# EasyEDA Pro project Ninjahub.eprj

# Schematic Schematic1
Board Name: Board1; Create Date: 2026-04-02; Page Name: P1; Project Name: Ninjahub; Schematic Name: Schematic1; Update Date: 2026-04-02; Company: EasyEDA.com; Page Size: A4; Version: V1.0
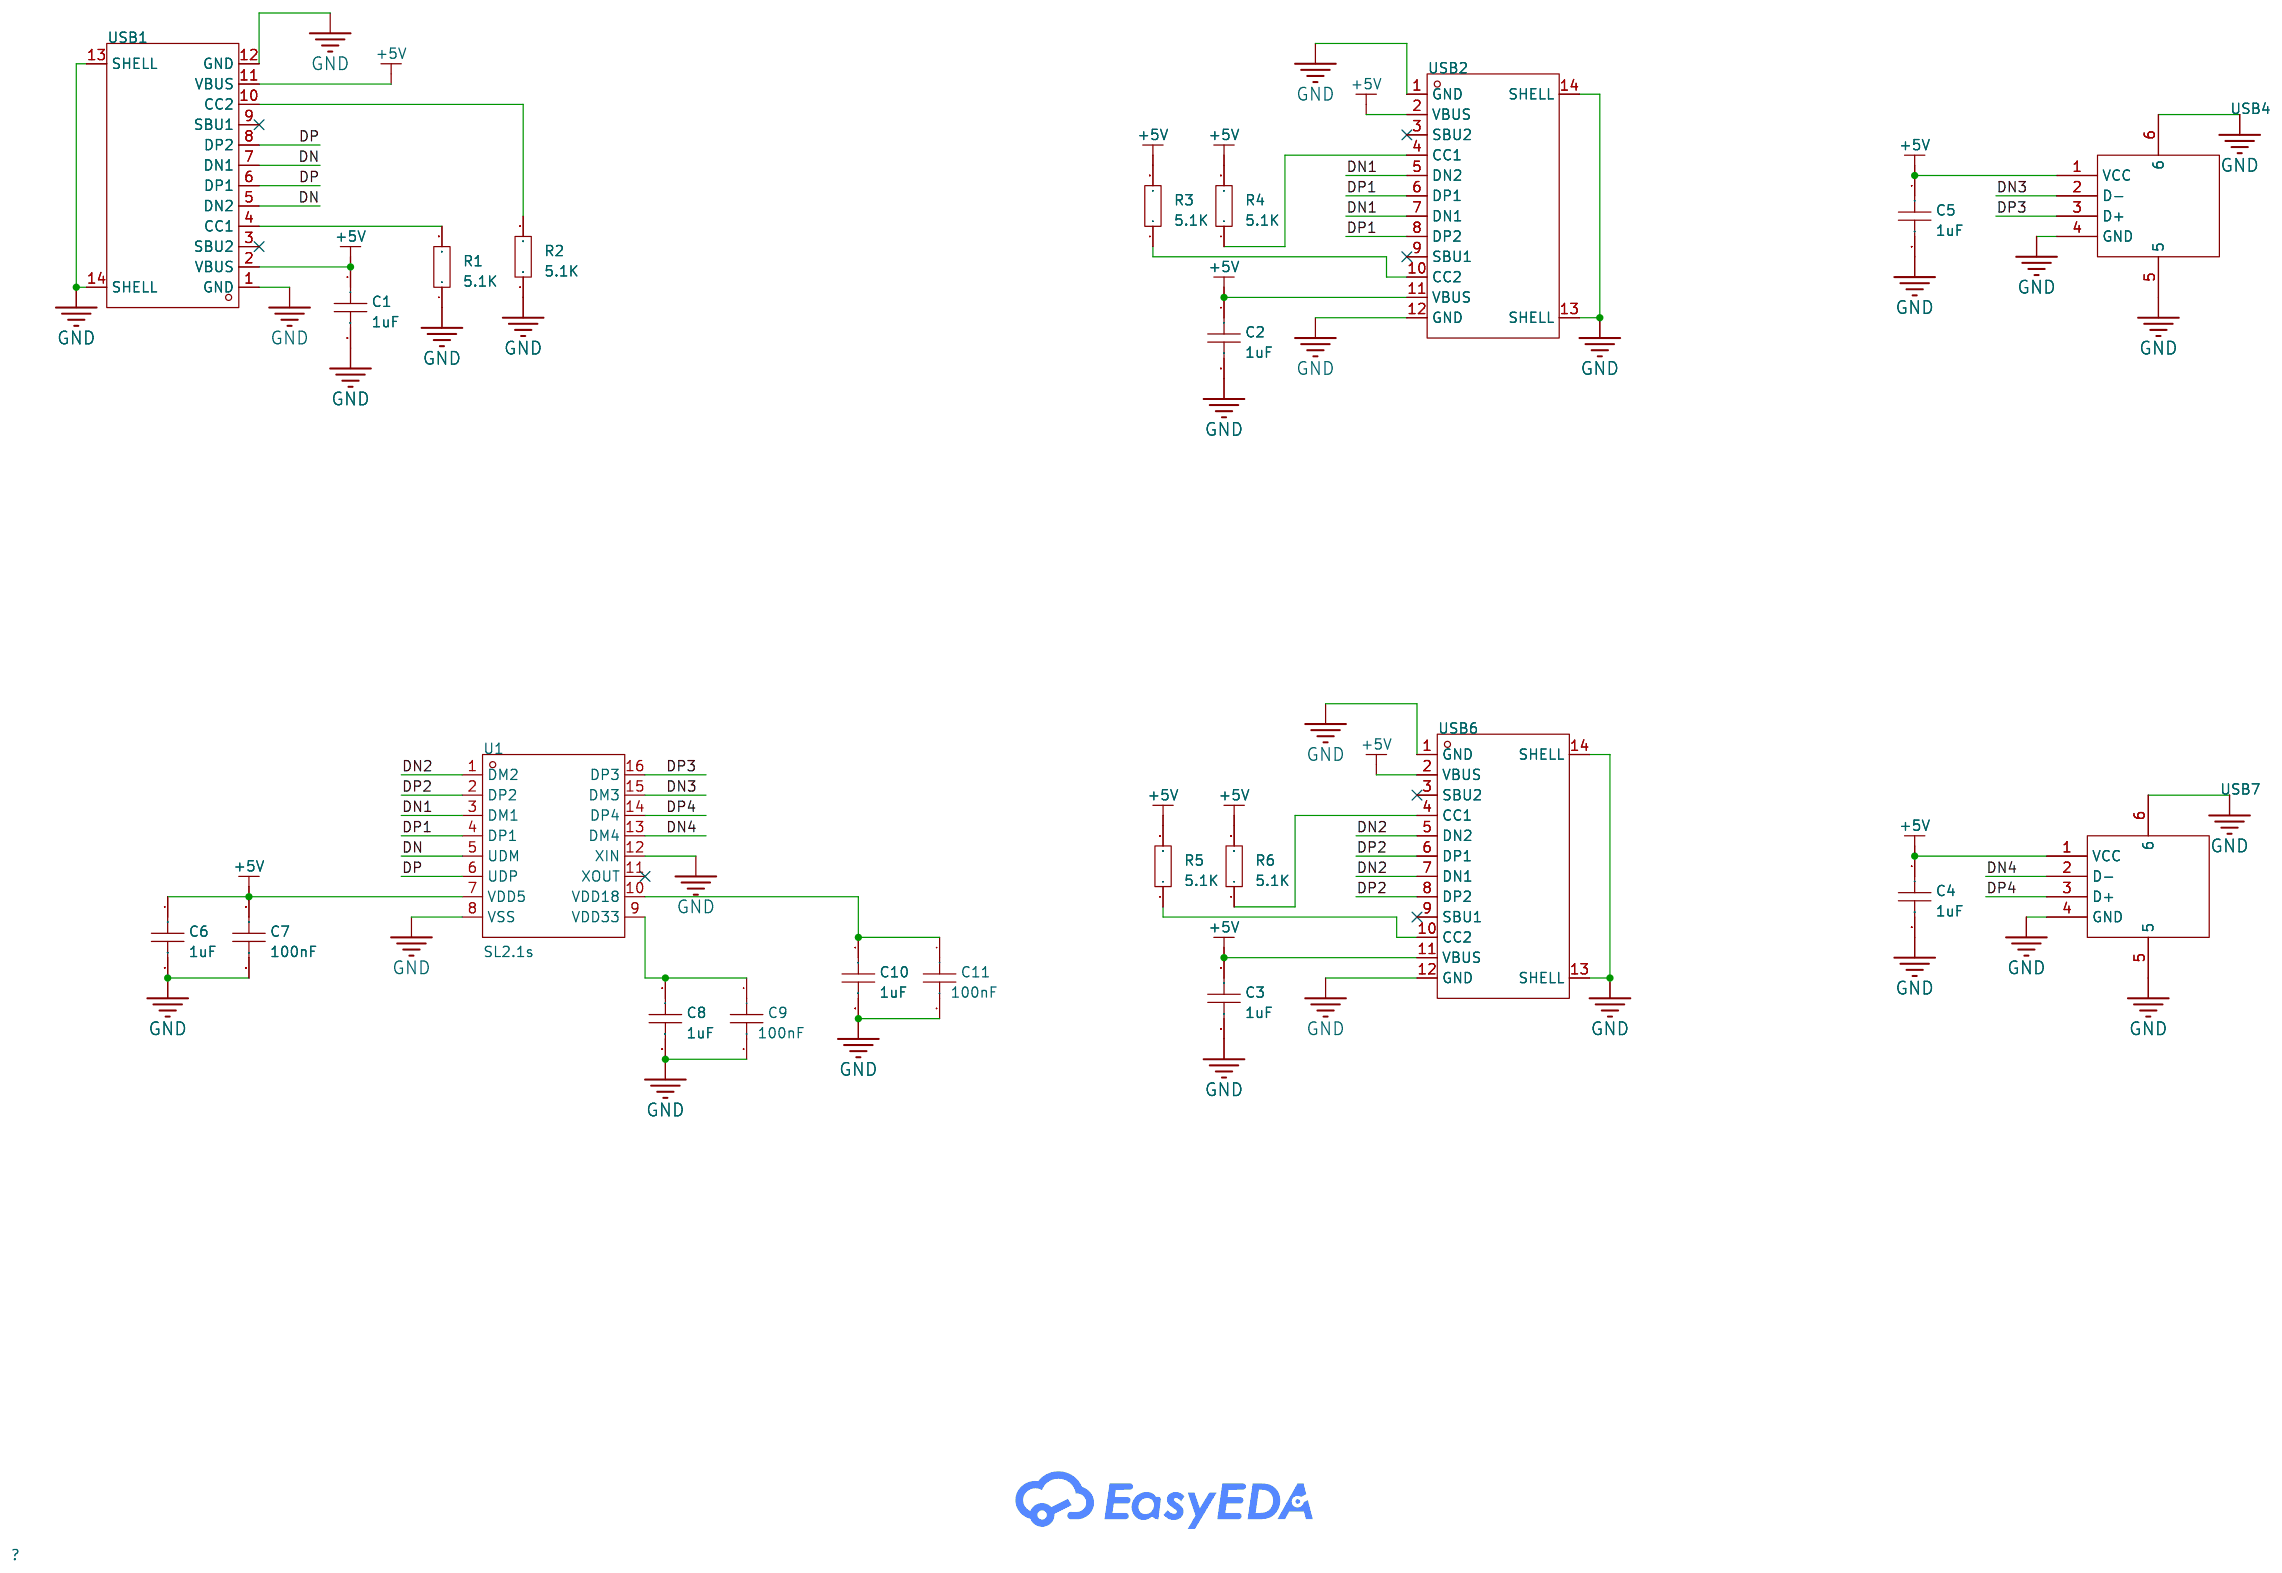
[diagram p0: schematic sheet]

## Parts
C1  1uF  [C0603]
C2  1uF  [C0603]
C3  1uF  [C0603]
C4  1uF  [C0603]
C5  1uF  [C0603]
C6  1uF  [C0603]
C7  100nF  [C0603]
C8  1uF  [C0603]
C9  100nF  [C0603]
C10  1uF  [C0603]
C11  100nF  [C0603]
R1  5.1K  [R0603]
R2  5.1K  [R0603]
R3  5.1K  [R0603]
R4  5.1K  [R0603]
R5  5.1K  [R0603]
R6  5.1K  [R0603]
U1  SL2.1s  [SSOP-16_L4.6-W2.6-P0.53-LS4.0-BL]
USB1  TYPE-C 16PIN 2MD(073)  [USB-C-SMD_TYPE-C-6PIN-2MD-073]
USB2  TYPE-C 16PIN 2MD(073)  [USB-C-SMD_TYPE-C-6PIN-2MD-073]
USB4  10.0 QHHTZB6.3  [USB-A-TH_10.0QHHTZB6.3]
USB6  TYPE-C 16PIN 2MD(073)  [USB-C-SMD_TYPE-C-6PIN-2MD-073]
USB7  10.0 QHHTZB6.3  [USB-A-TH_10.0QHHTZB6.3]

## Library data of the parts
C1-C11 = CAP_0603: Supplier Footprint: 0603
R1-R6 = Res_0603: Supplier Footprint: 0603
U1 = SL2.1s: LCSC Part Name: USB2.0 HUB控制器集成电路; Supplier Part: C2684433; Manufacturer: CoreChips(和芯润德); Supplier Footprint: SSOP-16; JLCPCB Part Class: Extended Part; Datasheet: https://item.szlcsc.com/datasheet/SL2.1s/2782346.html; Supplier: LCSC; type: Hub; USB Protocol: USB 2.0; Voltage - Supply: 4V~5.25V; Operating Temperature: 0℃~+70℃; Current - Supply: 120mA; Quiescent Supply Current: 2.5mA; Number of Channels: 4
USB1 USB2 USB6 = TYPE-C 16PIN 2MD(073): LCSC Part Name: Type-C 母 卧贴; Supplier Part: C2765186; Manufacturer: SHOU HAN(首韩); Supplier Footprint: SMD; JLCPCB Part Class: Extended Part; Datasheet: https://item.szlcsc.com/datasheet/TYPE-C%252016PIN%25202MD(073)/2901843.html; Supplier: LCSC; Connector Type: Type-C; Gender: Female; Mounting Type: Surface Mount, Right Angle; Number of Contacts: 16P; Number of Ports: 1; Current Rating-Power: 3A; Voltage Rating: 5V; Connect-Disconnect Life: 10,000 Cycles; Detection color: Black; Operating Temperature: -25℃~+85℃
USB4 USB7 = 10.0 QHHTZB6.3: LCSC Part Name: 壳长10.0mm; Supplier Part: C668591; Manufacturer: SHOU HAN(首韩); Supplier Footprint: SMD; JLCPCB Part Class: Extended Part; Datasheet: https://item.szlcsc.com/datasheet/10.0%2520QHHTZB6.3/698534.html; Supplier: LCSC; Connector Type: Type-A; Protocol Standard: USB 2.0; Gender: Female; Mounting Type: Surface Mount, Right Angle; Number of Contacts: 4P; Number of Ports: 1; Current Rating-Power: 1.5A; Voltage Rating: 30V; Connect-Disconnect Life: 5,000 times; Length: 10mm; Detection color: Black; Operating Temperature: -25℃~+85℃

## Nets
+5V: C1.1 C2.1 C3.1 C4.1 C5.1 C6.1 C7.1 R3.2 R4.2 R5.2 R6.2 U1.7(VDD5) USB1.2(VBUS) USB1.11(VBUS) USB2.2(VBUS) USB2.11(VBUS) USB4.1(VCC) USB6.2(VBUS) USB6.11(VBUS) USB7.1(VCC)
GND: C1.2 C2.2 C3.2 C4.2 C5.2 C6.2 C7.2 C8.2 C9.2 C10.2 C11.2 R1.1 R2.1 U1.8(VSS) U1.12(XIN) USB1.1(GND) USB1.12(GND) USB1.13(SHELL) USB1.14(SHELL) USB2.1(GND) USB2.12(GND) USB2.13(SHELL) USB2.14(SHELL) USB4.4(GND) USB4.5 USB4.6 USB6.1(GND) USB6.12(GND) USB6.13(SHELL) USB6.14(SHELL) USB7.4(GND) USB7.5 USB7.6
DN: U1.5(UDM) USB1.5(DN2) USB1.7(DN1)
DN1: U1.3(DM1) USB2.5(DN2) USB2.7(DN1)
DN2: U1.1(DM2) USB6.5(DN2) USB6.7(DN1)
DN3: U1.15(DM3) USB4.2(D-)
DN4: U1.13(DM4) USB7.2(D-)
DP: U1.6(UDP) USB1.6(DP1) USB1.8(DP2)
DP1: U1.4(DP1) USB2.6(DP1) USB2.8(DP2)
DP2: U1.2(DP2) USB6.6(DP1) USB6.8(DP2)
DP3: U1.16(DP3) USB4.3(D+)
DP4: U1.14(DP4) USB7.3(D+)
$1N974: R2.2 USB1.10(CC2)
$1N985: R1.2 USB1.4(CC1)
$1N1726: R3.1 USB2.10(CC2)
$1N1733: R4.1 USB2.4(CC1)
$1N2029: R5.1 USB6.10(CC2)
$1N2034: R6.1 USB6.4(CC1)
$1N2739: C8.1 C9.1 U1.9(VDD33)
$1N2763: C10.1 C11.1 U1.10(VDD18)

Not connected (* = marked no-connect by the designer): U1 11(XOUT)*; USB1 3(SBU2)* 9(SBU1)*; USB2 3(SBU2)* 9(SBU1)*; USB6 3(SBU2)* 9(SBU1)*

# Board PCB1
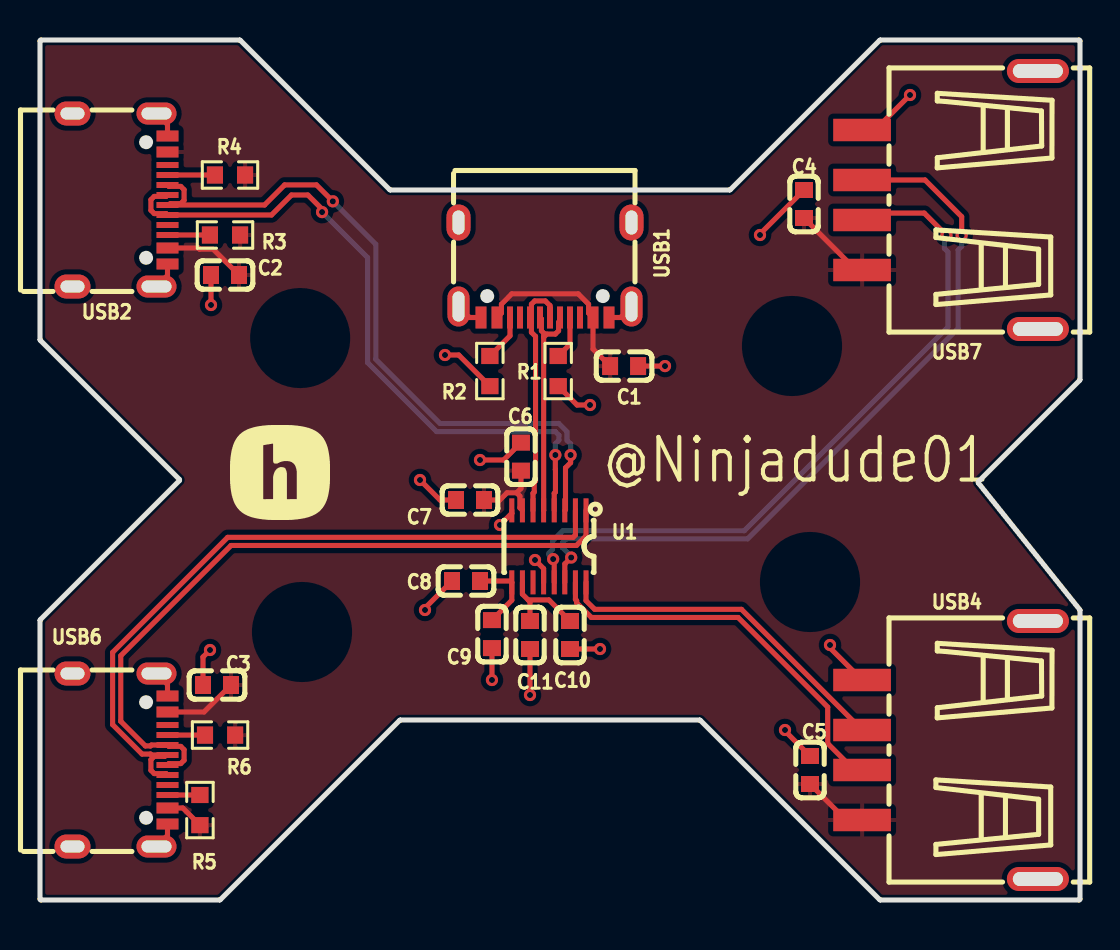
[diagram p1: board, top side]
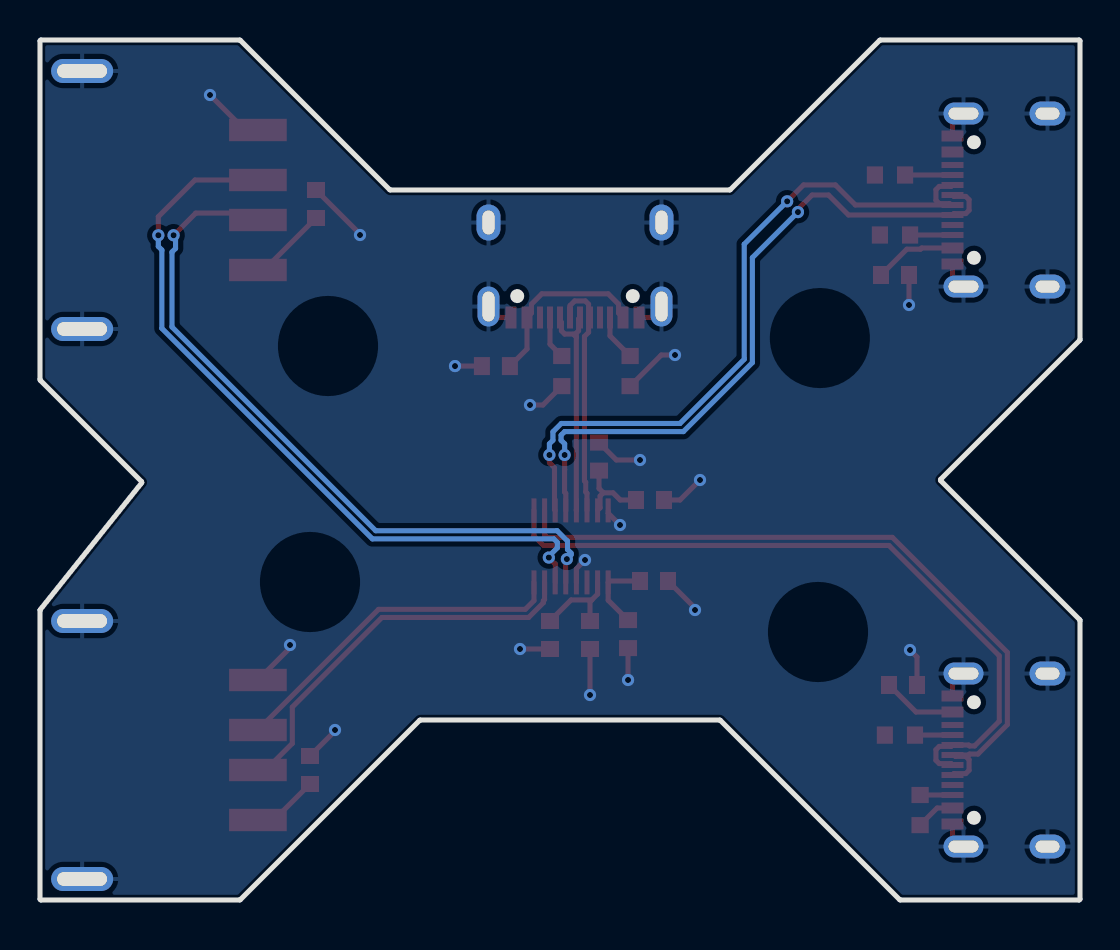
[diagram p2: board, bottom side, seen from below]

Outline 52 x 43 mm; copper layers: Top Layer, Inner1, Inner2, Inner3, Inner4, Inner5, Inner6, Inner7, Inner8, Inner9, Inner10, Inner11, Inner12, Inner13, Inner14, Inner15, Inner16, Inner17, Inner18, Inner19, Inner20, Inner21, Inner22, Inner23, Inner24, Inner25, Inner26, Inner27, Inner28, Inner29, Inner30, Bottom Layer. Coordinates in mm from the lower left corner of the outline.
Outline path: 0,42.95 arc(0.01,42.99) 0.05,43 9.98,43 arc(10,43) 10.01,42.98 17.49,35.52 arc(17.5,35.5) 17.52,35.5 34.48,35.5 arc(34.5,35.5) 34.51,35.52 41.99,42.98 arc(42,43) 42.02,43 51.95,43 arc(51.99,42.99) 52,42.95 52,26.02 arc(52,26) 51.99,25.98 46.92,20.92 arc(46.91,20.89) 46.92,20.85 51.99,14.51 arc(52,14.5) 52,14.48 52,0.05 arc(51.99,0.01) 51.95,0 42.02,0 arc(42,0) 41.99,0.02 33.01,8.98 arc(33,9) 32.98,9 18.02,9 arc(18,9) 17.99,8.98 9.02,0.02 arc(9,0) 8.98,0 0.05,0 arc(0.01,0.01) 0,0.05 0,13.98 arc(0,14) 0.02,14.02 6.96,20.96 arc(6.98,21) 6.96,21.04 0.02,27.98 arc(0,28) 0,28.02 0,42.95
Stack: Top Layer 0.035mm / Dielectric1 1.51mm FR4 er 4.5 / Bottom Layer 0.035mm

## Design rules (mm)
net DN2: DP3
net DP2: DP3
net DN1: DP2
net DP1: DP2
net DN: DP1
net DP: DP1
net DN4: DP5
net DP4: DP5
net DN3: DP4
net DP3: DP4
template: Custom Config
spacing copperThickness1oz (default): track to track 0.102, other pairs 0.152 to 0.3
spacing copperThickness2oz: track to track 0.203, other pairs 0.152 to 0.3
track width copperThickness1oz (default): min 0.127, default 0.254, max 2.54
track width copperThickness2oz: min 0.203, default 0.254, max 2.54
differential pair differentialPair (default): width min 0.127, default 0.254, max 2.54; gap min 0.152, default 0.152
via viaSize (default): diameter min 0.5, default 0.61, max 10; hole min 0.3, default 0.305, max 6.3

## Placement (name value [footprint] x y rotation side)
C1  1uF  [C0603]  29.2 26.7 0 top
C2  1uF  [C0603]  9.25 31.25 180 top
C3  1uF  [C0603]  8.85 10.75 180 top
C4  1uF  [C0603]  38.2 34.8 90 top
C5  1uF  [C0603]  38.5 6.5 90 top
C6  1uF  [C0603]  24.05 22.17 90 top
C7  100nF  [C0603]  21.5 20 180 top
C8  1uF  [C0603]  21.3 15.95 180 top
C9  100nF  [C0603]  22.6 13.3 270 top
C10  1uF  [C0603]  26.5 13.25 270 top
C11  100nF  [C0603]  24.5 13.25 270 top
R1  5.1K  [R0603]  25.91 26.45 90 top
R2  5.1K  [R0603]  22.49 26.45 90 top
R3  5.1K  [R0603]  9.25 33.25 0 top
R4  5.1K  [R0603]  9.5 36.25 0 top
R5  5.1K  [R0603]  8 4.5 270 top
R6  5.1K  [R0603]  9 8.25 0 top
U1  SL2.1s  [SSOP-16_L4.6-W2.6-P0.53-LS4.0-BL]  25.45 17.68 180 top
USB1  TYPE-C 16PIN 2MD(073)  [USB-C-SMD_TYPE-C-6PIN-2MD-073]  25.25 31.5 180 top
USB2  TYPE-C 16PIN 2MD(073)  [USB-C-SMD_TYPE-C-6PIN-2MD-073]  4 35 270 top
USB4  10.0 QHHTZB6.3  [USB-A-TH_10.0QHHTZB6.3]  45.5 7.5 90 top
USB6  TYPE-C 16PIN 2MD(073)  [USB-C-SMD_TYPE-C-6PIN-2MD-073]  4 7 270 top
USB7  10.0 QHHTZB6.3  [USB-A-TH_10.0QHHTZB6.3]  45.5 35 90 top

## Footprints (pads in the part's own frame, mm; a bottom-side part is the same pattern mirrored in y, then rotated)
C0603
  rect 0.8x0.9 smd: 1(-0.7,0) 2(0.7,0)
R0603
  rect 0.806x0.864 smd: 1(-0.753,0) 2(0.753,0)
SSOP-16_L4.6-W2.6-P0.53-LS4.0-BL
  rect 0.25x1.2 smd: 1(-1.855,-1.8) 2(-1.325,-1.8) 3(-0.795,-1.8) 4(-0.265,-1.8) 5(0.265,-1.8) 6(0.795,-1.8) 7(1.325,-1.8) 8(1.855,-1.8) 9(1.855,1.8) 10(1.325,1.8) 11(0.795,1.8) 12(0.265,1.8) 13(-0.265,1.8) 14(-0.795,1.8) 15(-1.325,1.8) 16(-1.855,1.8)
USB-A-TH_10.0QHHTZB6.3
  rect 1.12x2.88 smd: 1(-3.5,4.395) 2(-1,4.395) 3(1,4.395) 4(3.5,4.395)
  oval 1.2x3.1 hole 0.7x2.5: 5(-6.45,-4.395) 6(6.45,-4.395)
USB-C-SMD_TYPE-C-6PIN-2MD-073
  rect 0.55x1.1 smd: 1(-3.2,2.375) 2(-2.4,2.375) 11(2.4,2.375) 12(3.2,2.375)
  rect 0.3x1.1 smd: 3(-1.75,2.375) 4(-1.25,2.375) 5(-0.75,2.375) 6(-0.25,2.375) 7(0.25,2.375) 8(0.75,2.375) 9(1.25,2.375) 10(1.75,2.375)
  oval 1.1x2 hole 0.6x1.5: 13(-4.325,1.825) 14(4.325,1.825)
  oval 1.2x1.8 hole 0.6x1.2: 13(-4.325,-2.375) 14(4.325,-2.375)

## Nets
As in the schematic.

Pads without a net: U1 11; USB1 3 9; USB2 3 9; USB6 3 9

## Via types
v1: diameter 0.61, hole 0.305, Top Layer to Bottom Layer, 25 vias

## Routing (per net, layer and track width the routed paths; a pad name or vN(x,y) marks a point on that pad's centre or on a via; arc(x,y) is an arc through that point)
+5V: length 30.2
  Top Layer w0.254: 23.83,20.36 24,20.2 24,19.61 U1.7 ; 23.83,20.36 23.35,20.36 22.99,20 C7.1 ; 23.83,20.36 24.05,20.58 C6.1 ; C1.1 27.65,27.55 USB1.2 27.43,29.35 27.43,29.79 26.91,30.31 23.59,30.31 23.07,29.79 23.07,29.35 USB1.11 ; USB2.11 7.92,32.6 7.98,32.54 8.66,32.54 C2.1 ; R5.2 7.14,4.6 USB6.11 ; USB7.1 40.8,31.5 C4.1 ; USB4.1 40.3,4 C5.1 ; C3.1 8.2,9.4 USB6.2
GND: length 42.5
  Top Layer w0.254: v1(43.5,40.25) 41.75,38.5 USB7.4 ; USB2.1 6.38,38.78 USB2.13 ; v1(36,33.25) 36,33.3 C4.2 ; U1.8 23.59,19.34 v1(23,18.75) ; C8.2 19.25,14.6 v1(19.25,14.5) ; USB6.13 6.38,10.78 USB6.1 ; v1(24.75,17) 25.18,16.57 U1.12 ; C5.2 37.25,8.45 v1(37.25,8.5) ; v1(19,21) 20,20 C7.2 ; C2.2 v1(8.55,29.75) ; USB1.12 21.47,29.12 USB1.14 ; C9.2 v1(22.6,11) ; v1(27.5,24.75) 26.85,24.75 25.91,25.69 ; v1(8.5,12.5) 8.15,12.15 C3.2 ; USB2.12 6.38,31.22 USB2.14 ; v1(22,22) 23.18,22 C6.2 ; USB6.14 6.38,3.22 USB6.12 ; USB4.4 39.5,12.61 v1(39.5,12.75) ; 22.49,25.69 20.94,27.25 v1(20.25,27.25) ; C10.2 v1(28,12.55) ; C11.2 v1(24.5,10.25) ; C1.2 v1(31.25,26.7) ; USB1.13 29.03,29.12 USB1.1
DN: length 11.3
  Top Layer w0.254: 25.18,28.14 25.18,28.35 25.07,28.46 25.07,29.05 USB1.7 ; 25.18,28.14 25.34,28.3 25.77,28.3 25.93,28.46 25.93,28.89 26,28.96 USB1.5 ; 25.18,28.14 25.18,19.48 U1.5
DN1: length 35.4
  Top Layer w0.254: U1.3 26.28,19.52 26.28,21.61 26.53,21.86 v1(26.53,22.25) ; v1(14.64,34.93) 13.82,35.75 12.23,35.75 11.23,34.75 USB2.7 6.4,34.77 6.47,34.77 6.52,34.82 7.04,34.82 7.2,34.98 7.2,35.52 7.04,35.68 6.45,35.68 USB2.5
  Bottom Layer w0.254: v1(26.53,22.25) 26.53,22.81 26.35,22.99 26.35,23.41 25.93,23.83 20,23.83 16.79,27.04 16.79,32.79 v1(14.64,34.93)
DN2: length 35.5
  Top Layer w0.254: USB6.7 6.45,6.82 7.04,6.82 7.2,6.98 7.2,7.52 7.04,7.68 6.45,7.68 USB6.5 5.57,7.75 5.52,7.7 5.27,7.7 4.04,8.94 4.04,12.21 9.55,17.73 26.82,17.73 27.3,18.21 U1.1
DN3: length 19.8
  Top Layer w0.254: U1.15 26.77,15.03 26.83,14.97 26.83,14.86 27.57,14.13 34.9,14.13 39.39,9.64 39.39,7.82 40.71,6.5 USB4.2
DN4: length 36
  Top Layer w0.254: v1(45.32,33.24) 44.21,34.34 41.45,34.34 USB7.2 ; v1(25.66,17.05) 25.71,16.99 25.71,15.88
  Bottom Layer w0.254: v1(45.32,33.24) 45.22,33.14 45.22,32.58 45.4,32.4 45.4,28.65 35.21,18.46 26.14,18.46 25.63,17.95 25.63,17.52 25.45,17.35 25.45,17.26 v1(25.66,17.05)
DP: length 12.4
  Top Layer w0.254: 24.57,28.89 24.57,29.79 24.73,29.95 25.27,29.95 25.5,29.72 USB1.6 ; 24.57,28.89 24.57,28.39 24.78,28.18 24.78,20.95 24.71,20.89 24.71,20.4 24.65,20.34 U1.6 ; 24.57,28.89 24.5,28.96 USB1.8
DP1: length 34.4
  Top Layer w0.254: USB2.6 6.3,35.18 5.71,35.18 5.55,35.02 5.55,34.48 5.71,34.32 6.3,34.32 USB2.8 11.57,34.25 12.57,35.25 13.39,35.25 14.1,34.54 v1(14.1,34.4) ; v1(25.77,22.25) 25.77,21.52 25.77,21.51 25.77,20.4 25.71,20.34 25.71,19.48
  Bottom Layer w0.254: v1(14.1,34.4) 16.38,32.12 16.38,26.87 19.83,23.42 25.77,23.42 25.95,23.24 25.95,22.99 25.77,22.81 v1(25.77,22.25)
DP2: length 36.2
  Top Layer w0.254: U1.2 26.77,18.25 26.65,18.13 9.38,18.13 3.63,12.38 3.63,8.77 5.1,7.3 5.52,7.3 5.57,7.25 USB6.6 6.35,7.23 6.28,7.23 6.23,7.18 5.71,7.18 5.55,7.02 5.55,6.48 5.71,6.32 6.3,6.32 USB6.8
DP3: length 17.4
  Top Layer w0.254: U1.16 27.3,14.97 27.74,14.53 35.07,14.53 USB4.3
DP4: length 37.9
  Top Layer w0.254: v1(26.56,17.12) 26.24,16.8 U1.14 ; USB7.3 44.25,36 46.08,34.17 v1(46.08,33.24)
  Bottom Layer w0.254: v1(26.56,17.12) 26.56,17.18 26.13,17.61 26.13,17.88 26.31,18.06 35.38,18.06 45.91,28.58 45.91,32.5 46.08,32.68 v1(46.08,33.24)
$1N974: length 2.3
  Top Layer w0.254: R2.2 23.5,28.21 USB1.10
$1N985: length 2.2
  Top Layer w0.254: R1.2 26.5,27.79 USB1.4
$1N1726: length 2.1
  Top Layer w0.254: R3.1 USB2.10
$1N1733: length 2.4
  Top Layer w0.254: R4.1 USB2.4
$1N2029: length 1.6
  Top Layer w0.254: R5.1 USB6.10
$1N2034: length 1.9
  Top Layer w0.254: R6.1 6.38,8.25 USB6.4
$1N2739: length 3.9
  Top Layer w0.254: C8.1 23.52,15.95 U1.9 23.59,14.99 C9.1
$1N2763: length 4.6
  Top Layer w0.254: C10.1 25.45,15 24.41,15 ; 24.41,15 24.12,15.29 U1.10 ; 24.41,15 24.5,14.91 C11.1

## Copper pours and planes (outline as drawn; the poured copper is in the pictures)
+5V on Top Layer: -7.25,47.25 61.75,47.25 61.75,-9.75 -7.25,-9.75
GND on Bottom Layer: -6.5,49.5 64,49.5 64,-8.75 -6.5,-8.75

## Text on the board
Top Silkscreen Layer: @Ninjadude01
